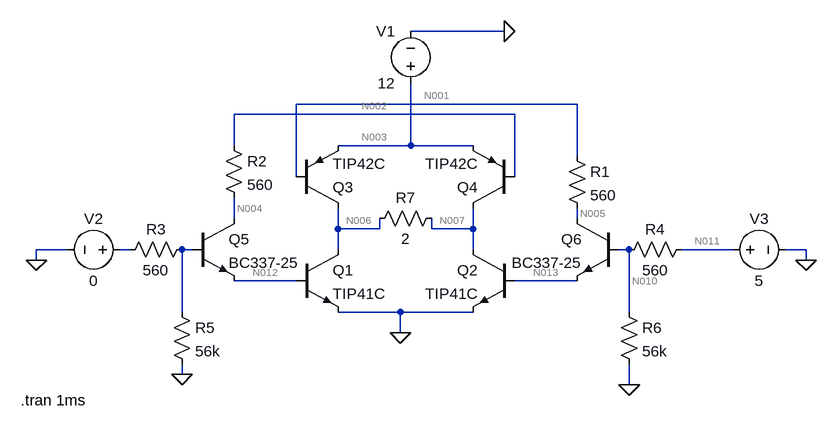
[diagram p0: schematic hbridge.asc]
hbridge.asc, the LTspice schematic file:
Version 4
SHEET 1 880 680
WIRE 368 -288 224 -288
WIRE 480 -176 48 -176
WIRE 384 -160 -48 -160
WIRE -48 -112 -48 -160
WIRE 224 -112 224 -208
WIRE 224 -112 112 -112
WIRE 320 -112 224 -112
WIRE 480 -96 480 -176
WIRE 48 -64 48 -176
WIRE 384 -64 384 -160
WIRE -48 0 -48 -32
WIRE 480 0 480 -16
WIRE 112 16 112 -16
WIRE 176 16 176 0
WIRE 176 16 112 16
WIRE 256 16 256 0
WIRE 320 16 320 -16
WIRE 320 16 256 16
WIRE -304 48 -352 48
WIRE -208 48 -224 48
WIRE -112 48 -128 48
WIRE 112 48 112 16
WIRE 320 48 320 16
WIRE 560 48 544 48
WIRE 720 48 640 48
WIRE 832 48 800 48
WIRE -352 64 -352 48
WIRE 832 64 832 48
WIRE 48 96 -48 96
WIRE 480 96 384 96
WIRE -128 144 -128 48
WIRE 208 144 112 144
WIRE 320 144 208 144
WIRE 560 144 560 48
WIRE 208 176 208 144
WIRE -128 240 -128 224
WIRE 560 256 560 224
FLAG 368 -288 0
FLAG 208 176 0
FLAG -128 240 0
FLAG 560 256 0
FLAG -352 64 0
FLAG 832 64 0
SYMBOL npn 48 48 R0
SYMATTR InstName Q1
SYMATTR Value TIP41C
SYMBOL npn 384 48 M0
SYMATTR InstName Q2
SYMATTR Value TIP41C
SYMBOL pnp 48 -16 M180
SYMATTR InstName Q3
SYMATTR Value TIP42C
SYMBOL pnp 384 -16 R180
SYMATTR InstName Q4
SYMATTR Value TIP42C
SYMBOL voltage 224 -192 R180
WINDOW 0 24 96 Left 2
WINDOW 3 24 16 Left 2
WINDOW 123 0 0 Left 2
WINDOW 39 0 0 Left 2
SYMATTR InstName V1
SYMATTR Value 12
SYMBOL npn -112 0 R0
SYMATTR InstName Q5
SYMATTR Value BC337-25
SYMBOL npn 544 0 M0
SYMATTR InstName Q6
SYMATTR Value BC337-25
SYMBOL res 464 -112 R0
SYMATTR InstName R1
SYMATTR Value 560
SYMBOL res -64 -128 R0
SYMATTR InstName R2
SYMATTR Value 560
SYMBOL voltage -208 48 R90
WINDOW 0 -32 56 VBottom 2
WINDOW 3 32 56 VTop 2
WINDOW 123 0 0 Left 2
WINDOW 39 0 0 Left 2
SYMATTR InstName V2
SYMATTR Value 0
SYMBOL voltage 704 48 M90
WINDOW 0 -32 56 VBottom 2
WINDOW 3 32 56 VTop 2
WINDOW 123 0 0 Left 2
WINDOW 39 0 0 Left 2
SYMATTR InstName V3
SYMATTR Value 5
SYMBOL res -112 32 R90
WINDOW 0 0 56 VBottom 2
WINDOW 3 32 56 VTop 2
SYMATTR InstName R3
SYMATTR Value 560
SYMBOL res 656 32 R90
WINDOW 0 0 56 VBottom 2
WINDOW 3 32 56 VTop 2
SYMATTR InstName R4
SYMATTR Value 560
SYMBOL res -144 128 R0
SYMATTR InstName R5
SYMATTR Value 56k
SYMBOL res 544 128 R0
SYMATTR InstName R6
SYMATTR Value 56k
SYMBOL res 272 -16 R90
WINDOW 0 0 56 VBottom 2
WINDOW 3 32 56 VTop 2
SYMATTR InstName R7
SYMATTR Value 2
TEXT -376 280 Left 2 !.tran 1ms

The netlist it stands for:
* hbridge.asc
Q1 N006 N012 0 0 TIP41C
Q2 N007 N013 0 0 TIP41C
Q3 N006 N001 N003 0 TIP42C
Q4 N007 N002 N003 0 TIP42C
V1 N003 0 12
Q5 N004 N009 N012 0 BC337-25
Q6 N005 N010 N013 0 BC337-25
R1 N001 N005 560
R2 N002 N004 560
V2 N008 0 0
V3 N011 0 5
R3 N009 N008 560
R4 N011 N010 560
R5 N009 0 56k
R6 N010 0 56k
R7 N007 N006 2
.model NPN NPN
.model PNP PNP
.lib standard.bjt
.tran 1ms
.backanno
.end

* Results of the author's LTspice run, read from the files saved beside the schematic
* Operating Point, zero values left out:
*   V(n006) = 2.674 V
*   V(n012) = 207.5 mV
*   V(n007) = 234.4 mV
*   V(n013) = 786.5 mV
*   V(n001) = 11.17 V
*   V(n003) = 12 V
*   V(n002) = 12 V
*   V(n004) = 12 V
*   V(n005) = 802.2 mV
*   V(n010) = 1.615 V
*   V(n011) = 5 V
*   Ic(Q6) = 18.52 mA
*   Ib(Q6) = 6.016 mA
*   Ie(Q6) = -24.53 mA
*   Ic(Q5) = 12.19 pA
*   Ib(Q5) = -12.41 pA
*   Ic(Q4) = -12.41 pA
*   Ib(Q4) = -12.19 pA
*   Ie(Q4) = 24.56 pA
*   Ic(Q3) = -1.22 A
*   Ib(Q3) = -18.52 mA
*   Ie(Q3) = 1.238 A
*   Ic(Q2) = 1.22 A
*   Ib(Q2) = 24.53 mA
*   Ie(Q2) = -1.244 A
*   Ic(Q1) = 1.231 nA
*   Ie(Q1) = -1.231 nA
*   I(R7) = -1.22 A
*   I(R6) = 28.84 µA
*   I(R4) = 6.045 mA
*   I(R3) = 12.28 pA
*   I(R2) = 12.19 pA
*   I(R1) = 18.52 mA
*   I(V3) = -6.045 mA
*   I(V2) = 12.28 pA
*   I(V1) = -1.238 A